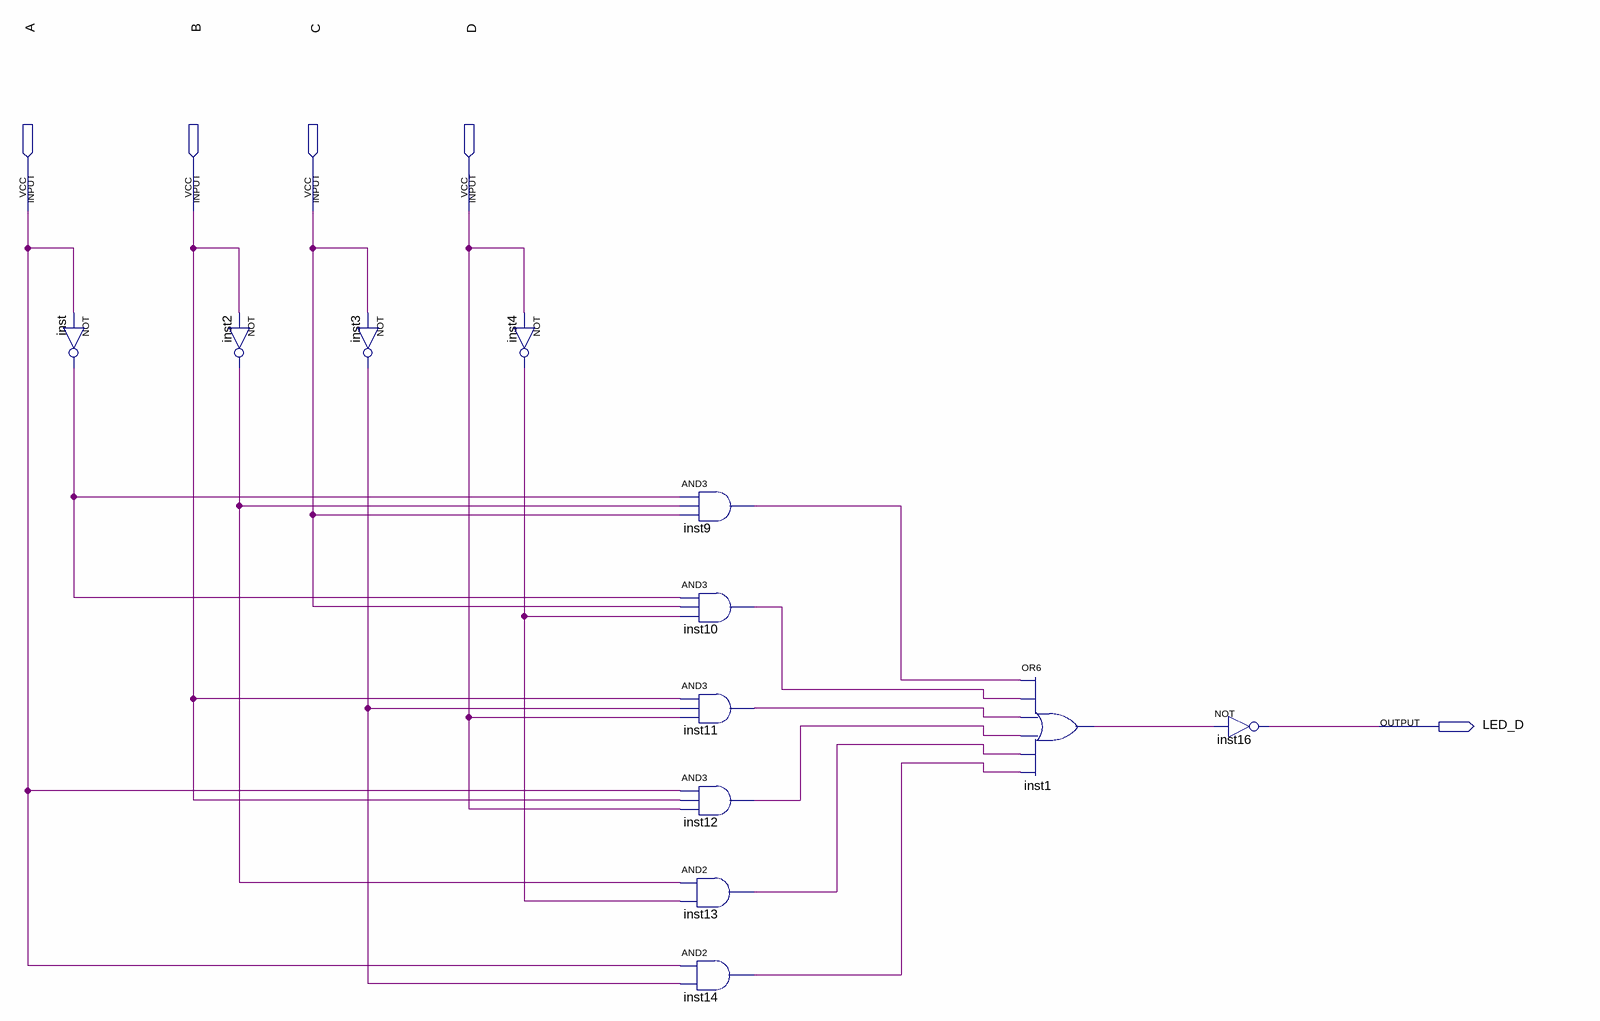
[diagram p0: schematic sheet]
// Quartus schematic led_d.bdf as structural Verilog: 12 symbols, 5 pins
module led_d (
  input  A,
  input  B,
  input  C,
  input  D,
  output LED_D
);

  wire inst1_out, inst2_out, inst3_out, inst4_out, inst9_out, inst10_out, inst11_out, inst12_out, inst13_out,
       inst14_out, inst_out;

  not inst (inst_out, A);
  not inst2 (inst2_out, B);
  not inst3 (inst3_out, C);
  not inst4 (inst4_out, D);
  and inst9 (inst9_out, inst_out, inst2_out, C);
  and inst10 (inst10_out, inst_out, C, inst4_out);
  and inst11 (inst11_out, B, inst3_out, D);
  and inst12 (inst12_out, A, B, D);
  and inst13 (inst13_out, inst2_out, inst4_out);
  and inst14 (inst14_out, A, inst3_out);
  or inst1 (inst1_out, inst9_out, inst10_out, inst11_out, inst12_out, inst13_out, inst14_out);
  not inst16 (LED_D, inst1_out);
endmodule
